# Altium schematic sheet Sheet1.SchDoc
size A; SheetNumber: 1; SheetTotal: 1
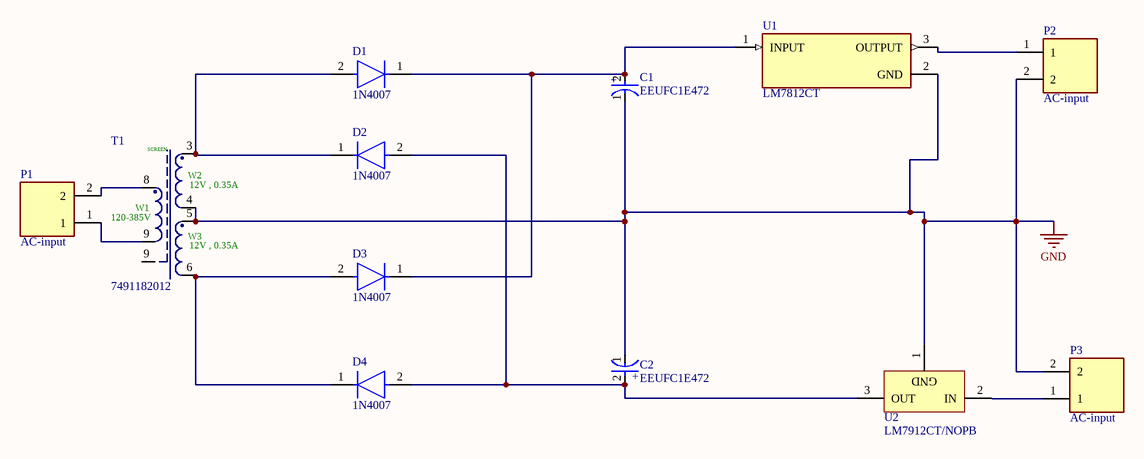
[diagram p0: Sheet1.SchDoc]

## Parts
C1  EEUFC1E472  [FP-RAD-TH-D_18_0_5-L_35_5-MFG]
C2  EEUFC1E472  [FP-RAD-TH-D_18_0_5-L_35_5-MFG]
D1  1N4007  [FP-1N4007-MFG]
D2  1N4007  [FP-1N4007-MFG]
D3  1N4007  [FP-1N4007-MFG]
D4  1N4007  [FP-1N4007-MFG]
P1  AC-input  [HANDSON_KF301-2P]
P2  AC-input  [HANDSON_KF301-2P]
P3  AC-input  [HANDSON_KF301-2P]
T1  7491182012  [EE16_7_4 (E16)]
U1  LM7812CT  [FP-TO220B03-MFG]
U2  LM7912CT/NOPB  [NDE0003A]

## Nets
GND: C1.1(C) C2.1(C) P2.2 P3.2 T1.4 T1.5 U1.2(GND) U2.1(GND)
NetC1_2: C1.2(A) D1.1(C) D3.1(C) U1.1(INPUT)
NetC2_2: C2.2(A) D2.2(A) D4.2(A) U2.3(OUT)
NetD1_2: D1.2(A) D2.1(C) T1.3
NetD3_2: D3.2(A) D4.1(C) T1.6
NetP1_1: P1.1 T1.9
NetP1_2: P1.2 T1.8
NetP2_1: P2.1 U1.3(OUTPUT)
NetP3_1: P3.1 U2.2(IN)

## Notes on the sheet
- (in symbol CMP-1471-00001-1) SCREEN; W2; 12V , 0.35A; W1; 120-385V; W3
- (in symbol CMP-05427-001130-1) +

## Library data of the parts
C1 C2 = CMP-05427-001130-1: Aluminum Electrolytic Capacitors (Radial Lead Type) AEC-Q200 Qualified 4700uF ±20% 25V; Capacitance: 4.7mF; Dielectric Material: Aluminium; Lead Diameter: 0.8mm; Ripple Current (AC): 3.68A; Life (Hours): 5000Hour; ESR (Equivalent Series Resistance): 15mR; Leakage Current: 3uA; Value: 4.7mF; Case/Package: Radial; Number of Pins: 2; Packaging: Bulk; Voltage Rating: 25V; Contact Plating: Tin; Height: 35.5mm; REACH SVHC: No SVHC; Features: General Purpose; Voltage Rating (DC): 25V; Height - Seated (Max): 1.398inch; Voltage: 25V; Ripple Current: 3.68A; Min Operating Temperature: -55°C; Mount: Through Hole; Lead Free: Lead Free; Package Quantity: 50; RoHS Compliant: Yes; Radiation Hardening: No; Impedance: 15mR; Diameter: 18mm; Series: FC; Construction: RADIAL; Tolerance: 20%; Length: 35mm; Max Operating Temperature: 105°C; Lead Pitch: 7.5mm; Termination: Radial
D1-D4 = CMP-123542-000001-1: Rectifier diode 1000 V 1 A DO-41, ,; Manufacturer: Diotec; Max Surge Forward Current: 27A; Forward Current: 1A; Max Junction Temp: +175°C; Reverse Voltage: 1000V; Value: 15pF; Peak Reverse Current: 5uA; Category: Diode; Temperature Range Low: -50°C; Automotive: No; Temperature: -50°C to +175°C; Lead Free: Yes; ComponentLink2Description: Datasheet; Max Repetitive Reverse Voltage: 1000V; ComponentLink2URL: https://datasheet.octopart.com/1N4007-Diotec-datasheet-62346875.pdf; Manufacturer Part Number: 1N4007; Device Class L3: Rectifier Diodes; Height: 2.8mm; Octopart: https://octopart.com/1n4007-diotec-4040411; Package: 1N4007; Temperature Range High: +175°C; Device Class L1: Discrete Semiconductors; Device Class L2: Diodes; RoHS: TRUE; Capacitance: 15pF; Ipc Land Pattern Name: DIOAD888W100L520D280
P1-P3 = KF301-2P: 2 Pin Terminal Block 5mm Pitch; MF: Handson Technology; SnapEDA_Link: https://www.snapeda.com/parts/KF301-2P/Handson+Technology/view-part/?ref=snap; Package: None; Value: *; MP: KF301-2P; Check_prices: https://www.snapeda.com/parts/KF301-2P/Handson+Technology/view-part/?ref=eda
T1 = CMP-1471-00001-1: Off-Line Transformer WE-UNIT , L=0.9mH; Manufacturer: Wuerth Elektronik; Turns Ratio: "9.5","1:1"; Inductance: 0.9mH; Output Voltage (DC): 12; Output Current (A): 0.6; Input Voltage (AC): 85-265; ComponentLink1Description: Manufacturer URL; ComponentLink1URL: http://www.we-online.com; PackageReference: EE16_7_4 (E16); ComponentLink2Description: Datasheet; ComponentLink2URL: http://www.we-online.de/katalog/media/pdf/7491182012.pdf; PartNumber: 7491182012
U1 = CMP-07128-000015-1: IC REG LINEAR 12V 1A TO220-3; Obsolete Part: true; Manufacturer: ON Semiconductor; Nominal Supply Current: 5.1mA; Output Type: Fixed; Dropout Voltage: 2V; Max Supply Voltage: 35V; Accuracy Percentage: 4%; Standoff Height: 2.7mm; Number Of Outputs: 1; Octopart: https://octopart.com/lm7812ct-on+semiconductor-14383031; Output Current: 1A; ComponentLink2Description: Datasheet; Device Class L1: Integrated Circuits (ICs); Device Class L2: Power Management ICs; Temperature Range Low: -40°C; Category: IC; Package: TO220B03; Device Class L3: Voltage Regulators - Linear; RoHS: TRUE; Digikey Description: IC REG LINEAR 12V 1A TO220-3; Ipc Land Pattern Name: TO-220; Output Voltage: 12V; Temperature: -40°C to +125°C; Automotive: No; Temperature Range High: +125°C; ComponentLink2URL: https://www.mouser.in/datasheet/2/308/LM7812-1125088.pdf; Manufacturer Part Number: LM7812CT; Height: 20.4mm; Lead Free: Yes
U2 = CMP-0062-02473-3: 3-Terminal Negative Regulator, 3-pin TO-220, Pb-Free; Manufacturer: Texas Instruments; PackageTopMarking: NSUZXYTTE#*LM7912CT; CompType: LDO IC; PowerWise: N; RoHS: Y; PackageDescription: TO-220, Molded, 3 Lead, Straight; PackageReference: NDE0003A; PinCount: 3; ComponentLink1URL: http://www.ti.com/general/docs/lit/getliterature.tsp?genericPartNumber=LM7912&fileType=pdf; ComponentLink1Description: Datasheet URL